# EAGLE schematic StmPulse-V2-inprogress (EAGLE 9.5.2)

## Sheet 1 of 6: Processor
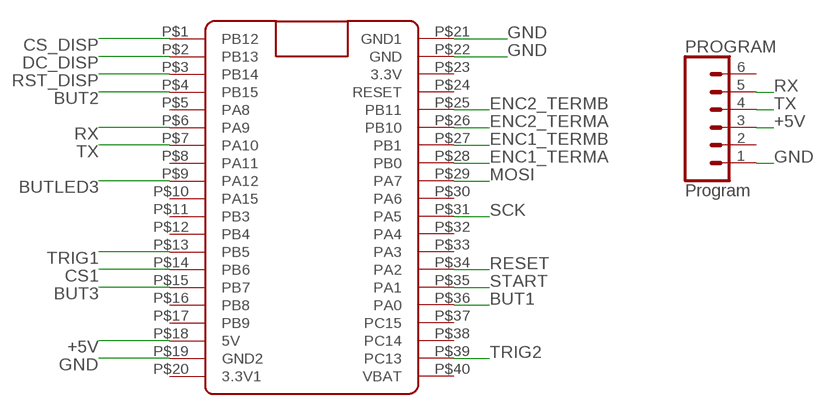
[diagram p0: schematic, sheet 1]

### Parts
PROGRAM  Program  CONN_06SILK_FEMALE_PTH  [1X06]
U$1  Blue Pill  BLUE_PILL  [BLUE_PILL]

### Nets
+5V: PROGRAM.3 U$1.P$18(5V) ; also sheet 2,3,4,5,6
BUT1 [Power]: U$1.P$36(PA0) ; also sheet 2
BUT2 [Power]: U$1.P$4(PB15) ; also sheet 2
BUT3: U$1.P$15(PB7) ; also sheet 2
BUTLED3: U$1.P$9(PA12) ; also sheet 2
CS1: U$1.P$14(PB6) ; also sheet 6
CS_DISP: U$1.P$1(PB12) ; also sheet 3,4
DC_DISP: U$1.P$2(PB13) ; also sheet 3,4
ENC1_TERMA: U$1.P$28(PB0) ; also sheet 2
ENC1_TERMB: U$1.P$27(PB1) ; also sheet 2
ENC2_TERMA: U$1.P$26(PB10) ; also sheet 2
ENC2_TERMB: U$1.P$25(PB11) ; also sheet 2
GND [Power]: PROGRAM.1 U$1.P$19(GND2) U$1.P$21(GND1) U$1.P$22(GND) ; also sheet 2,3,4,5,6
MOSI: U$1.P$29(PA7) ; also sheet 3,4,6
RESET: U$1.P$34(PA2) ; also sheet 2
RST_DISP: U$1.P$3(PB14) ; also sheet 3,4
RX: PROGRAM.5 U$1.P$6(PA9)
SCK: U$1.P$31(PA5) ; also sheet 3,4,6
START: U$1.P$35(PA1) ; also sheet 2
TRIG1: U$1.P$13(PB5) ; also sheet 2
TRIG2: U$1.P$39(PC13) ; also sheet 2
TX: PROGRAM.4 U$1.P$7(PA10)
Unconnected: PROGRAM.2 PROGRAM.6 U$1.P$5(PA8) U$1.P$8(PA11) U$1.P$10(PA15) U$1.P$11(PB3) U$1.P$12(PB4) U$1.P$16(PB8) U$1.P$17(PB9) U$1.P$20(3.3V1) U$1.P$23(3.3V) U$1.P$24(RESET) U$1.P$30(PA6) U$1.P$32(PA4) U$1.P$33(PA3) U$1.P$37(PC15) U$1.P$38(PC14) U$1.P$40(VBAT)

## Sheet 2 of 6: IO
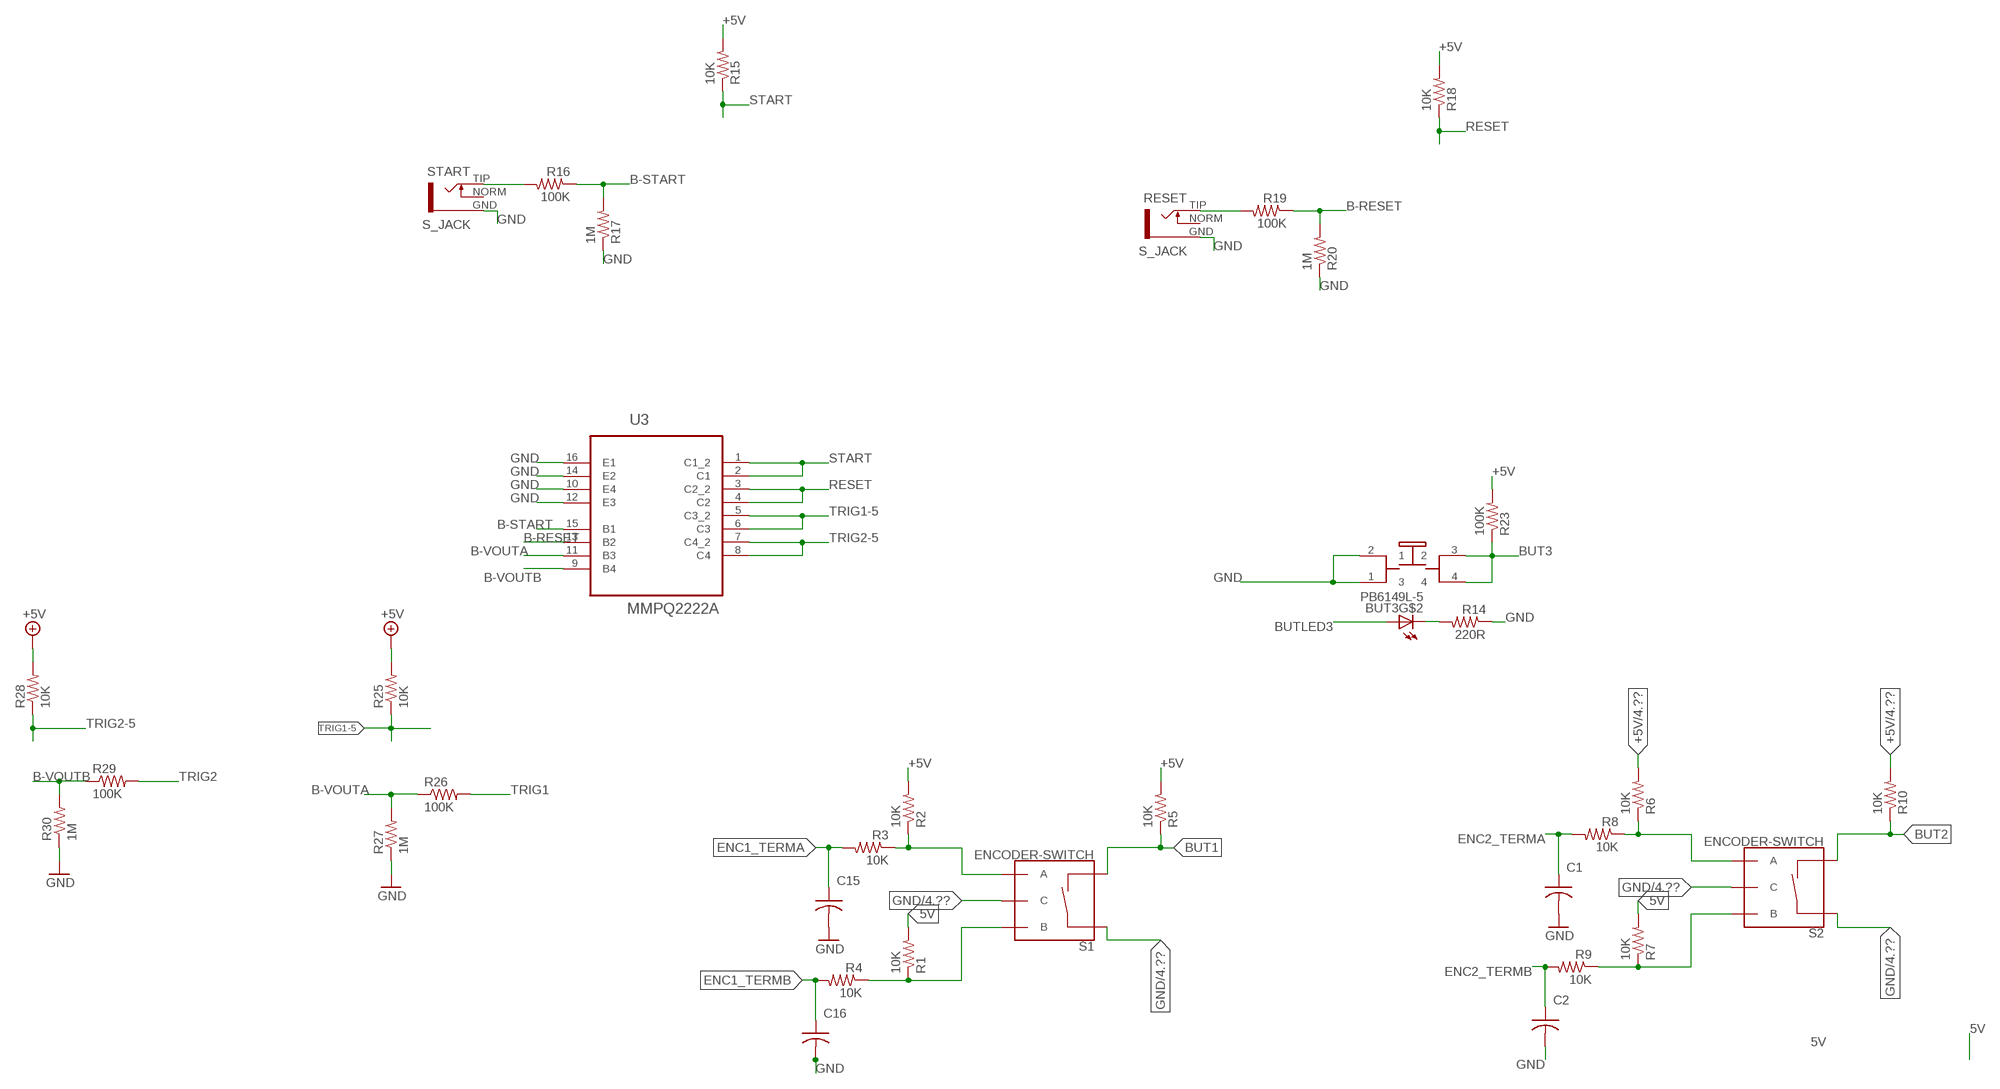
[diagram p1: schematic, sheet 2]

### Parts
BUT3  PB6149L-5  [PB6149L]
C1  10nF  C-USC0805  [C0805]
C2  10nF  C-USC0805  [C0805]
C15  10nF  C-USC0805  [C0805]
C16  10nF  C-USC0805  [C0805]
R1  10K  R-US_R0805  [R0805]
R2  10K  R-US_R0805  [R0805]
R3  10K  R-US_R0805  [R0805]
R4  10K  R-US_R0805  [R0805]
R5  10K  R-US_R0805  [R0805]
R6  10K  R-US_R0805  [R0805]
R7  10K  R-US_R0805  [R0805]
R8  10K  R-US_R0805  [R0805]
R9  10K  R-US_R0805  [R0805]
R10  10K  R-US_R0805  [R0805]
R14  220R  R-US_R0805  [R0805]
R15  10K  R-US_R0805  [R0805]
R16  100K  R-US_R0805  [R0805]
R17  1M  R-US_R0805  [R0805]
R18  10K  R-US_R0805  [R0805]
R19  100K  R-US_R0805  [R0805]
R20  1M  R-US_R0805  [R0805]
R23  100K  R-US_R0805  [R0805]
R25  10K  R-US_R0805  [R0805]
R26  100K  R-US_R0805  [R0805]
R27  1M  R-US_R0805  [R0805]
R28  10K  R-US_R0805  [R0805]
R29  100K  R-US_R0805  [R0805]
R30  1M  R-US_R0805  [R0805]
RESET  S_JACK  [S_JACK]
S1  ENCODER-SWITCH  [ROTARY_ENC_PLAIN]
S2  ENCODER-SWITCH  [ROTARY_ENC_PLAIN]
START  S_JACK  [S_JACK]
U3  MMPQ2222A  [SOIC127P600X175-16N]

### Nets
5V: R1.2 R7.2
+5V: R2.2 R5.2 R6.2 R10.2 R15.2 R18.2 R23.2 R25.2 R28.2 ; also sheet 1,3,4,5,6
B-RESET: R19.1 R20.2 U3.13(B2)
B-START: R16.1 R17.2 U3.15(B1)
B-VOUTA: R26.1 R27.2 U3.11(B3)
B-VOUTB: R29.1 R30.2 U3.9(B4)
BUT1 [Power]: R5.1 S1.SW- ; also sheet 1
BUT2 [Power]: R10.1 S2.SW- ; also sheet 1
BUT3: BUT3.3 BUT3.4 R23.1 ; also sheet 1
BUTLED3: BUT3.A ; also sheet 1
ENC1_TERMA: C15.1 R3.2 ; also sheet 1
ENC1_TERMB: C16.1 R4.2 ; also sheet 1
ENC2_TERMA: C1.1 R8.2 ; also sheet 1
ENC2_TERMB: C2.1 R9.2 ; also sheet 1
GND [Power]: BUT3.1 BUT3.2 C1.2 C2.2 C15.2 C16.2 R14.1 R17.1 R20.1 R27.1 R30.1 RESET.GND S1.C S1.SW+ S2.C S2.SW+ START.GND U3.10(E4) U3.12(E3) U3.14(E2) U3.16(E1) ; also sheet 1,3,4,5,6
N$1: R6.1 R8.1 S2.A
N$2: R7.1 R9.1 S2.B
N$6: R2.1 R3.1 S1.A
N$12: R1.1 R4.1 S1.B
N$15: BUT3.K(C) R14.2
N$18: R19.2 RESET.TIP
N$26: R16.2 START.TIP
RESET: R18.1 U3.3(C2_2) U3.4(C2) ; also sheet 1
START: R15.1 U3.1(C1_2) U3.2(C1) ; also sheet 1
TRIG1: R26.2 ; also sheet 1
TRIG1-5: R25.1 U3.5(C3_2) U3.6(C3) ; also sheet 5
TRIG2: R29.2 ; also sheet 1
TRIG2-5: R28.1 U3.7(C4_2) U3.8(C4) ; also sheet 5
Unconnected: RESET.NORM START.NORM

## Sheet 3 of 6: Power
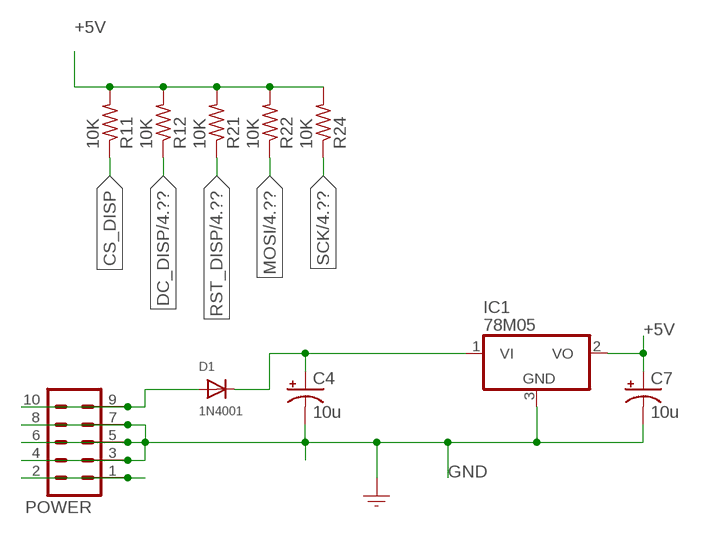
[diagram p2: schematic, sheet 3]

### Parts
C4  10u  CAPACITOR_POL-US153CLV-0505  [153CLV-0505]
C7  10u  CAPACITOR_POL-US153CLV-0505  [153CLV-0505]
D1  1N4001  DIODESMA  [SMADIODE]
IC1  78M05  VOLTAGE_REG_POS05DT  [TO252]
POWER  CONN_05X2SHD_SMD  [2X5-SHROUDED_SMD]
R11  10K  R-US_R0805  [R0805]
R12  10K  R-US_R0805  [R0805]
R21  10K  R-US_R0805  [R0805]
R22  10K  R-US_R0805  [R0805]
R24  10K  R-US_R0805  [R0805]

### Nets
+5V: C7.+ IC1.2(VO) R11.2 R12.2 R21.2 R22.2 R24.2 ; also sheet 1,2,4,5,6
+12V: C4.+ D1.C IC1.1(VI)
CS_DISP: R11.1 ; also sheet 1,4
DC_DISP: R12.1 ; also sheet 1,4
GND [Power]: C4.- C7.- IC1.3(GND) POWER.3 POWER.4 POWER.5 POWER.6 POWER.7 POWER.8 ; also sheet 1,2,4,5,6
MOSI: R22.1 ; also sheet 1,4,6
N$9: D1.A POWER.9 POWER.10
N$10: POWER.1 POWER.2
RST_DISP: R21.1 ; also sheet 1,4
SCK: R24.1 ; also sheet 1,4,6

## Sheet 4 of 6: OLED
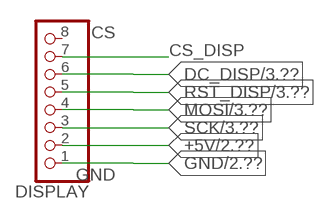
[diagram p3: schematic, sheet 4]

### Parts
DISPLAY  MICROBUILDER_HEADER-1X8ROUND  [MICROBUILDER_1X08_ROUND]

### Nets
+5V: DISPLAY.2 ; also sheet 1,2,3,5,6
CS_DISP: DISPLAY.7 ; also sheet 1,3
DC_DISP: DISPLAY.6 ; also sheet 1,3
GND [Power]: DISPLAY.1 ; also sheet 1,2,3,5,6
MOSI: DISPLAY.4 ; also sheet 1,3,6
RST_DISP: DISPLAY.5 ; also sheet 1,3
SCK: DISPLAY.3 ; also sheet 1,3,6
Unconnected: DISPLAY.8

### Notes on the sheet
- CS
- GND

## Sheet 5 of 6: Out
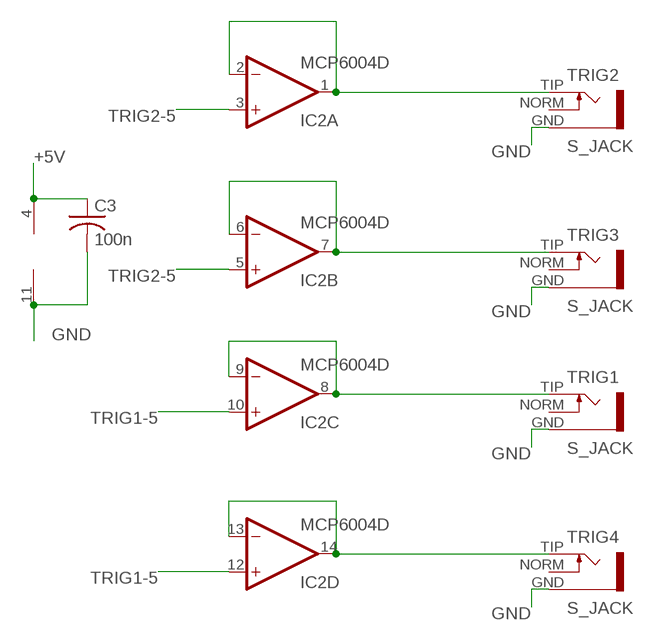
[diagram p4: schematic, sheet 5]

### Parts
C3  100n  C-USC0805K  [C0805K]
IC2  MCP6004D  [SO14]
TRIG1  S_JACK  [S_JACK]
TRIG2  S_JACK  [S_JACK]
TRIG3  S_JACK  [S_JACK]
TRIG4  S_JACK  [S_JACK]

### Nets
+5V: C3.1 IC2.4(P:V+) ; also sheet 1,2,3,4,6
GND [Power]: C3.2 IC2.11(P:V-) TRIG1.GND TRIG2.GND TRIG3.GND TRIG4.GND ; also sheet 1,2,3,4,6
N$7: IC2.1(A:OUT) IC2.2(A:-IN) TRIG2.TIP
N$8: IC2.8(C:OUT) IC2.9(C:-IN) TRIG1.TIP
N$13: IC2.6(B:-IN) IC2.7(B:OUT) TRIG3.TIP
N$14: IC2.13(D:-IN) IC2.14(D:OUT) TRIG4.TIP
TRIG1-5: IC2.10(C:+IN) IC2.12(D:+IN) ; also sheet 2
TRIG2-5: IC2.3(A:+IN) IC2.5(B:+IN) ; also sheet 2
Unconnected: TRIG1.NORM TRIG2.NORM TRIG3.NORM TRIG4.NORM

## Sheet 6 of 6: DAC
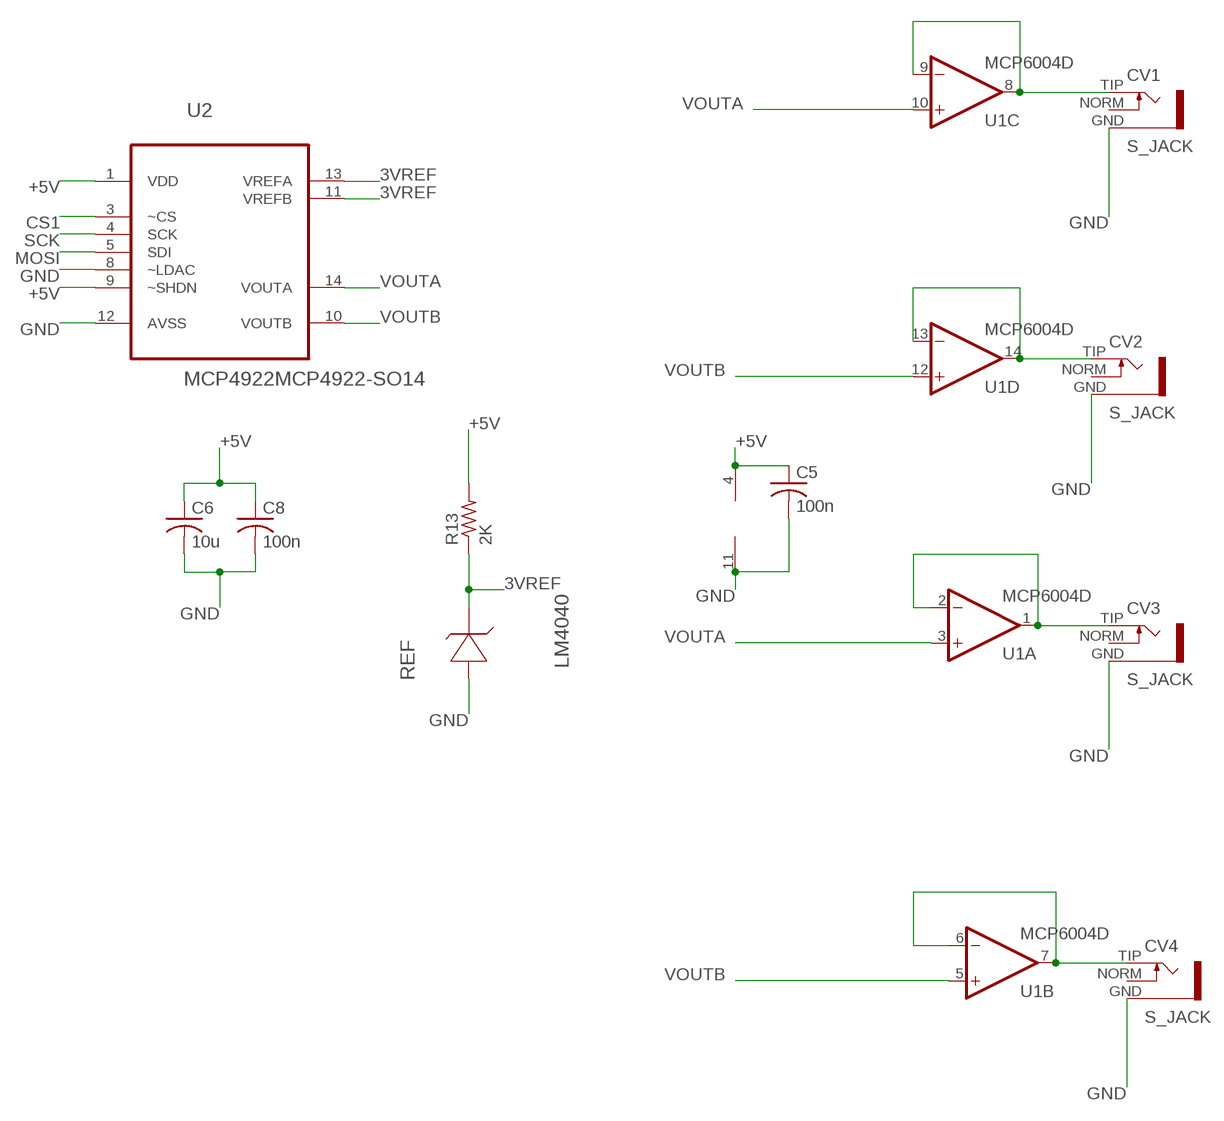
[diagram p5: schematic, sheet 6]

### Parts
C5  100n  C-USC0805K  [C0805K]
C6  10u  C-USC0805K  [C0805K]
C8  100n  C-USC0805K  [C0805K]
CV1  S_JACK  [S_JACK]
CV2  S_JACK  [S_JACK]
CV3  S_JACK  [S_JACK]
CV4  S_JACK  [S_JACK]
R13  2K  R-US_R0805  [R0805]
REF  LM4040  LM4040A30IDBZT  [SOT95P237X112-3N]
U1  MCP6004D  [SO14]
U2  MCP4922MCP4922-SO14  [SO14]

### Nets
3VREF: R13.1 REF.1(CATHODE) U2.11(VREFB) U2.13(VREFA)
+5V: C5.1 C6.1 C8.1 R13.2 U1.4(P:V+) U2.1(VDD) U2.9(~SHDN) ; also sheet 1,2,3,4,5
CS1: U2.3(~CS) ; also sheet 1
GND [Power]: C5.2 C6.2 C8.2 CV1.GND CV2.GND CV3.GND CV4.GND REF.2(ANODE) U1.11(P:V-) U2.8(~LDAC) U2.12(AVSS) ; also sheet 1,2,3,4,5
MOSI: U2.5(SDI) ; also sheet 1,3,4
N$4: CV3.TIP U1.1(A:OUT) U1.2(A:-IN)
N$5: CV4.TIP U1.6(B:-IN) U1.7(B:OUT)
N$11: CV1.TIP U1.8(C:OUT) U1.9(C:-IN)
N$36: CV2.TIP U1.13(D:-IN) U1.14(D:OUT)
SCK: U2.4(SCK) ; also sheet 1,3,4
VOUTA: U1.3(A:+IN) U1.10(C:+IN) U2.14(VOUTA)
VOUTB: U1.5(B:+IN) U1.12(D:+IN) U2.10(VOUTB)
Unconnected: CV1.NORM CV2.NORM CV3.NORM CV4.NORM REF.3(NC)

## Library data of the parts
BUT3 = INSTRUO:PB6149L-5
C1-C3 C5 C6 C8 C15 C16 = rcl:C-US: CAPACITOR, American symbol
C4 C7 = GMSN:CAPACITOR_POL-US: POLARIZED CAPACITOR, American symbol
CV1-CV4 RESET START TRIG1-TRIG4 = INSTRUO:S_JACK
D1 = GMSN:DIODE: Diode SMADIODE - SMA Surface Mount Package 20V 1A Schottky Diode Digikey: 641-1014-6-ND DO-1N4148 - Through Hole Small Current Diode SOD-123 20V 1 A (.5mV Vf) Schottky Diode - Digikey: MBRX120TPMSCT-ND SOD-323 10V 570mA (.38mV Vf, 3ns) Schottky Diode - Digikey: ZLLS410CT-ND SOD-523 30V 30mA Schottky Diode (RB751S-40TE61) - Digikey: RB751S-40TE61CT-ND SOT23-R/W - SOT23 Package (R = Solder Paste/Reflow Ovens, W = Hand-Soldering) BAT54Film 40V 300mA - Digikey: 497-7162-1-ND
DISPLAY = Adafruit_1.3_128x64_OLED:MICROBUILDER_HEADER-1X8: PIN HEADER
IC1 = GMSN:VOLTAGE_REG_POS: Positive VOLTAGE REGULATOR Added bigger pads to the TO-92 package
IC2 = GMSN-R2Project:MCP6004: OP AMP
POWER = SparkFun-Connectors:CONN_05X2: Multi connection point. Often used as Generic Header-pin footprint for 0.1 inch spaced/style header connections For AVR SPI programming port, see special device with nice symbol: "AVR_SPI_PROG_5x2.dev" You can populate with any combo of single row headers, but if you'd like an exact match, check these: 2x5 AVR ICSP Male Header <https://www.sparkfun.com/products/778> (PRT-00778) 2x5 Pin Shrouded Header <https://www.sparkfun.com/products/8506> (PRT-08506) On any of the 0.1 inch spaced packages, you can populate with these: Break Away Headers - Straight <https://www.sparkfun.com/products/116> (PRT-00116) Break Away Male Headers - Right Angle <https://www.sparkfun.com/products/553> (PRT-00553) Female Headers <https://www.sparkfun.com/products/115> (PRT-00115) Break Away Headers - Machine Pin <https://www.sparkfun.com/products/117> (PRT-00117) Break Away Female Headers - Swiss Machine Pin <https://www.sparkfun.com/products/743> (PRT-00743) Special note: the shrouded connector mates well with our 5x2 ribbon cables: 2x5 Pin IDC Ribbon Cable <https://www.sparkfun.com/products/8535> (PRT-08535); PROD_ID: CONN-09508; RS-PART: 828-1783
PROGRAM = SparkFun-Connectors:CONN_06: Multi connection point. Often used as Generic Header-pin footprint for 0.1 inch spaced/style header connections On any of the 0.1 inch spaced packages, you can populate with these: Break Away Headers - Straight <https://www.sparkfun.com/products/116> (PRT-00116) Break Away Male Headers - Right Angle <https://www.sparkfun.com/products/553> (PRT-00553) Female Headers <https://www.sparkfun.com/products/115> (PRT-00115) Break Away Headers - Machine Pin <https://www.sparkfun.com/products/117> (PRT-00117) Break Away Female Headers - Swiss Machine Pin <https://www.sparkfun.com/products/743> (PRT-00743) Arduino Stackable Header - 6 Pin <https://www.sparkfun.com/products/9280> (PRT-09280) For SCREWTERMINALS and SPRING TERMINALS visit here: Screw Terimnals on SparkFun.com <https://www.sparkfun.com/search/results?term=Screw+Terminals> (5mm/3.5mm/2.54mm spacing) This device is also useful as a general connection point to wire up your design to another part of your project. Our various solder wires solder well into these plated through hole pads. Hook-Up Wire - Assortment (Stranded, 22 AWG) <https://www.sparkfun.com/products/11375> (PRT-11375) Hook-Up Wire - Assortment (Solid Core, 22 AWG) <https://www.sparkfun.com/products/11367> (PRT-11367) View the entire wire category on our website here <https://www.sparkfun.com/categories/141>; PROD_ID: CONN-08437
R1-R30 = rcl:R-US_: RESISTOR, American symbol
REF = GMSN-R2Project:LM4040A30IDBZT: PRECISION MICROPOWER SHUNT VOLTAGE REFERENCE; MPN: LM4040A30IDBZT; OC_FARNELL: 1755108; OC_NEWARK: 58K5870; PACKAGE: 3-SOT-23; RS-PART: 809-6343; SUPPLIER: TEXAS INSTRUMENTS
S1 S2 = SparkFun-Switches:ENCODER-SWITCH: Rotary Encoder w/ Select Switch Encoders rotate similarly to potentiometers, but they’re different from potentiometers in that an encoder has full rotation without limits. They output gray code so that you can tell how much and in which direction the encoder has been turned. This encoder includes a push-down select switch built into the shaft. SparkFun Products Rotary Encoder <https://www.sparkfun.com/products/9117> (COM-09117); SF_SKU: COM-09117
U1 = GMSN-R2Project:MCP6004: OP AMP; RS-PART: 628-3481 (10)
U2 = GMSN-R2Project:MCP4922; RS-PART: 402-910
U3 = Fairchild_By_element14_Batch_1:MMPQ2222A: NPN Multi-Chip General Purpose Amplifier; MPN: MMPQ2222A; OC_FARNELL: 2101390; OC_NEWARK: 10P1562; PACKAGE: SOIC-16; SUPPLIER: FAIRCHILD SEMICONDUCTOR
U$1 = BluePill:BLUE_PILL

## Net classes
1 Power: width 0.61 mm